# Altium schematic sheet AudioPath.SchDoc
size A3; DocumentNumber: 8; SheetNumber: 8; SheetTotal: 8
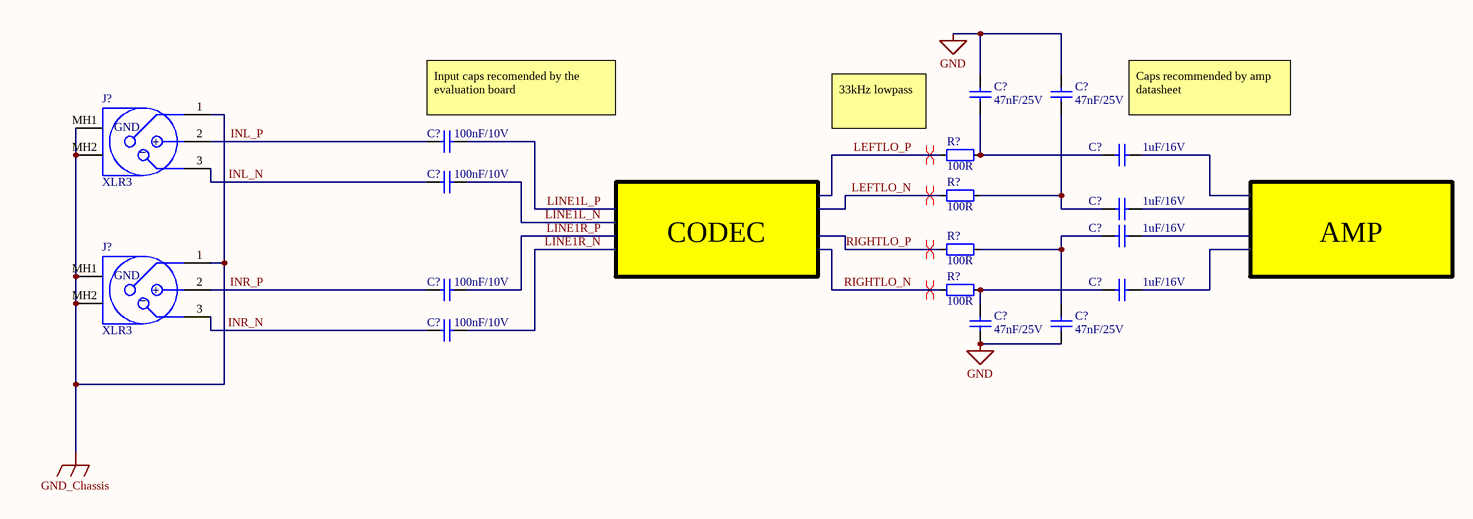
[diagram p0: AudioPath.SchDoc]

## Parts
(Parts that share a designator on the sheet are numbered #1, #2 ... from top to bottom, then left to right.)
C?#1  47nF/25V  [C0402]
C?#2  47nF/25V  [C0402]
C?#3  100nF/10V  [C0402]
C?#4  1uF/16V  [C0603]
C?#5  100nF/10V  [C0402]
C?#6  1uF/16V  [C0603]
C?#7  1uF/16V  [C0603]
C?#8  100nF/10V  [C0402]
C?#9  1uF/16V  [C0603]
C?#10  47nF/25V  [C0402]
C?#11  47nF/25V  [C0402]
C?#12  100nF/10V  [C0402]
J?#1  XLR3  [NC3FAAH1]
J?#2  XLR3  [NC3FAAH1]
R?#1  100R  [R0402]
R?#2  100R  [R0402]
R?#3  100R  [R0402]
R?#4  100R  [R0402]

## Nets
GND: C?#1.2 C?#2.2 C?#10.1 C?#11.1
GND_Chassis: J?#1.1(GND) J?#1.MH1 J?#1.MH2 J?#2.1(GND) J?#2.MH1 J?#2.MH2
INL_N: C?#5.2 J?#1.3(-)
INL_P: C?#3.2 J?#1.2(+)
INR_N: C?#12.2 J?#2.3(-)
INR_P: C?#8.2 J?#2.2(+)
LEFTLO_N: R?#2.1
LEFTLO_P: R?#1.1
LINE1L_N: C?#5.1
LINE1L_P: C?#3.1
LINE1R_N: C?#12.1
LINE1R_P: C?#8.1
RIGHTLO_N: R?#4.1
RIGHTLO_P: R?#3.1
NetC?#1_1: C?#1.1 C?#4.2 R?#1.2
NetC?#2_1: C?#2.1 C?#6.2 R?#2.2
NetC?#7_2: C?#7.2 C?#11.2 R?#3.2
NetC?#9_2: C?#9.2 C?#10.2 R?#4.2

Not connected (* = marked no-connect by the designer): C?#4 1; C?#6 1; C?#7 1; C?#9 1

## Layout directives
differential pair: LEFTLO_N, LEFTLO_P, RIGHTLO_N, RIGHTLO_P

## Notes on the sheet
- (near C?#3) Input caps recomended by the evaluation board
- 33kHz lowpass
- (near C?#4) Caps recommended by amp datasheet
- CODEC
- AMP
- Title
- Size:
- Date:
- A3
- Number:
- Time:
- Revision:
- Sheet
- of
- File:
- (in symbol NC3FAAH1) _

## Library data of the parts
C?#1 C?#2 C?#10 C?#11 = C0402: Manufacturer Part Number: 885012205048; Voltage: 25V; Tolerance: 10%; Specifications: X7R 47nF 25V ±10%; Capacitance: 47nF; Dielectric: X7R; Supplier 1: Mouser; Supplier Part Number 1: 710-885012205048
C?#3 C?#5 C?#8 C?#12 = C0402: Manufacturer Part Number: 885012105010; Voltage: 10V; Tolerance: 20%; Specifications: X7R 100nF 10V ±20%; Capacitance: 100nF; Dielectric: X7R; Supplier 1: Mouser; Supplier Part Number 1: 710-885012105010
C?#4 C?#6 C?#7 C?#9 = C0603: Manufacturer Part Number: 885012206052; Voltage: 16V; Tolerance: 10%; Specifications: X7R 1uF 16V ±10%; Capacitance: 1uF; Dielectric: X7R; Supplier 1: Mouser; Supplier Part Number 1: 710-885012206052
J?#1 J?#2 = NC3FAAH1: XLR Connectors 3P FEMALE HORIZ PIN 1 & GRD TOGETHER; Manufacturer Part Number: NC3FAAH1; Supplier 1: Mouser; Supplier Part Number 1: 568-NC3FAAH-1; ComponentLink1Description: Datasheet; ComponentLink1URL: http://www.neutrik.us/en-us/xlr/aa-series/nc3faah1
R?#1-R?#4 = R0402: Manufacturer Part Number: ERJ-2RHD5600X; Power Rating: 63mW; Tolerance: 1%; Specifications: 100R 63mW ±1%; Resistance: 100R; Supplier 1: Mouser; Supplier Part Number 1: 667-ERJ-2RHD5600X